# Altium project PS004.PrjPcb
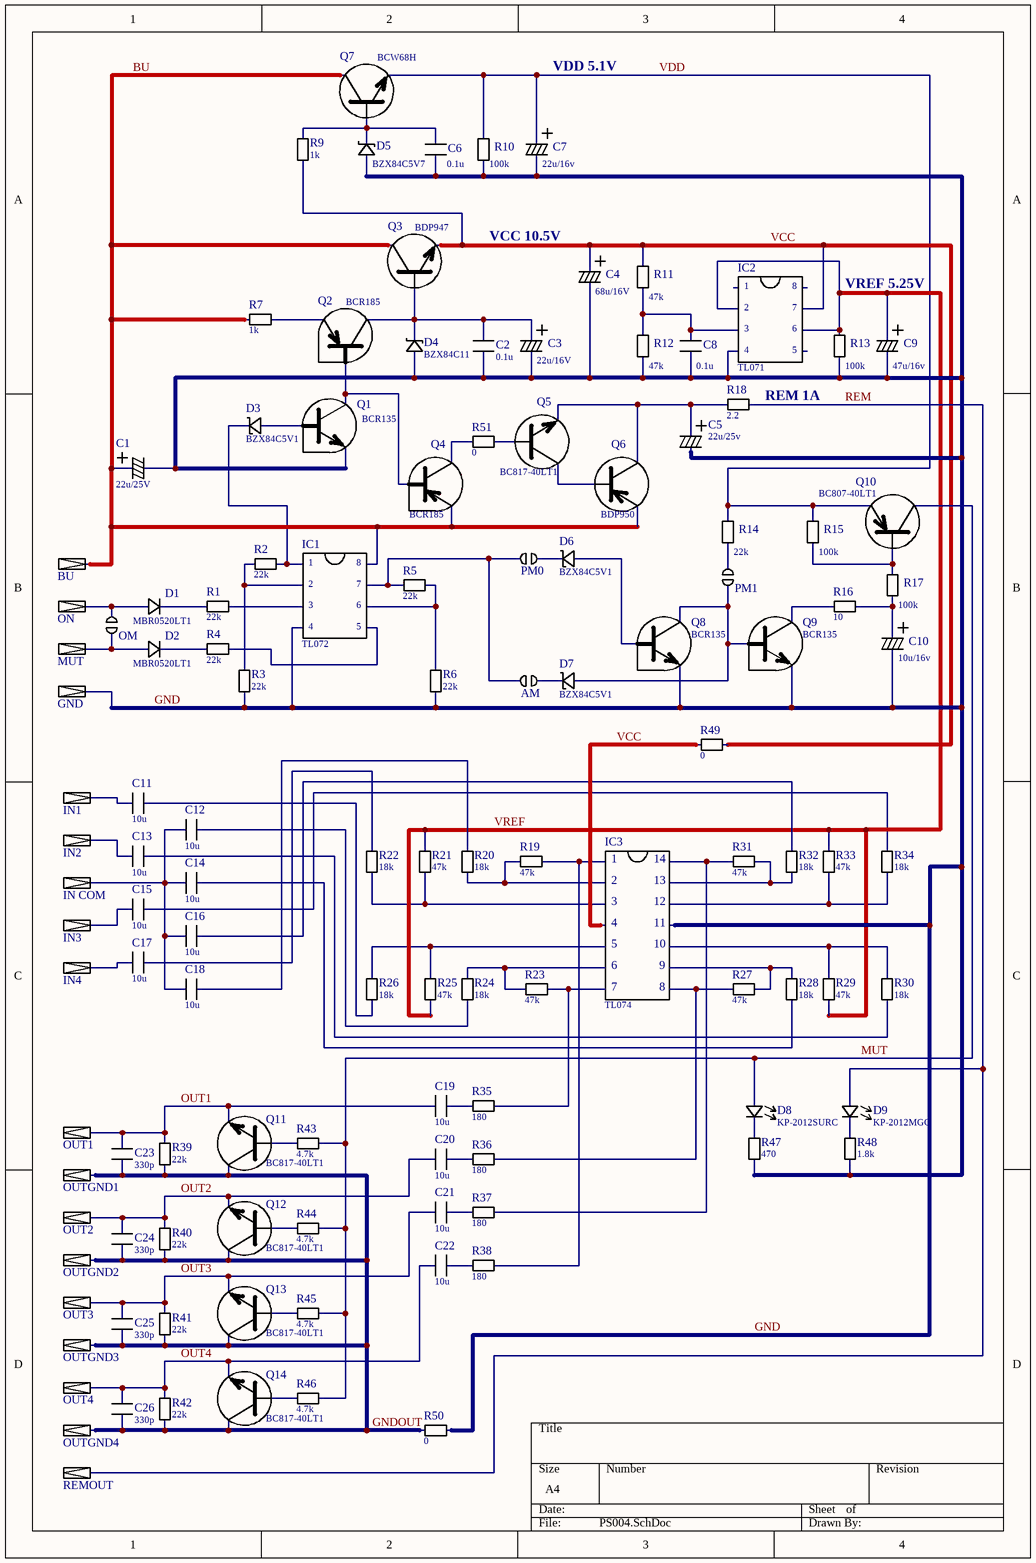
[diagram p0: PS004.SchDoc]
1 sheet, 124 parts. Net scope: global (net labels, ports and power ports of the same name join across sheets).
Board file: PS004.PcbDoc

## Sheet PS004.SchDoc
size A4 portrait; PageSetup: Record=PageOptions|CenterHorizontal=True|CenterVertical=True|PrintScale=0.97|XCorrection=1.00|YCorrection=1.00|PrintKind=1|BorderSize=5000000|LeftOffset=0|BottomOffset=0|Orientation=1|PaperLength=1000|PaperWidth=1000|Scale=100|PaperSource=7|PrintQuality=-4|MediaType=1|DitherType=10|PaperKind=A4|PrintScaleMode=1

### Parts
AM  SC plan  [SC]  (value not drawn)
BU  IN plan  [IO]  (value not drawn)
C1  Capasitance: 22u/25V  [C]  (hidden comment: C plan pol)
C2  Capasitance: 0.1u  [0805]  (hidden comment: C plan cer)
C3  Capasitance: 22u/16V  [C]  (hidden comment: C plan pol)
C4  Capasitance: 68u/16V  [C]  (hidden comment: C plan pol)
C5  Capasitance: 22u/25v  [C]  (hidden comment: C plan pol)
C6  Capasitance: 0.1u  [0805]  (hidden comment: C plan cer)
C7  Capasitance: 22u/16v  [C]  (hidden comment: C plan pol)
C8  Capasitance: 0.1u  [0805]  (hidden comment: C plan cer)
C9  Capasitance: 47u/16v  [C]  (hidden comment: C plan pol)
C10  Capasitance: 10u/16v  [C]  (hidden comment: C plan pol)
C11  Capasitance: 10u  [1206]  (hidden comment: C plan cer)
C12  Capasitance: 10u  [1206]  (hidden comment: C plan cer)
C13  Capasitance: 10u  [1206]  (hidden comment: C plan cer)
C14  Capasitance: 10u  [1206]  (hidden comment: C plan cer)
C15  Capasitance: 10u  [1206]  (hidden comment: C plan cer)
C16  Capasitance: 10u  [1206]  (hidden comment: C plan cer)
C17  Capasitance: 10u  [1206]  (hidden comment: C plan cer)
C18  Capasitance: 10u  [1206]  (hidden comment: C plan cer)
C19  Capasitance: 10u  [1206]  (hidden comment: C plan cer)
C20  Capasitance: 10u  [1206]  (hidden comment: C plan cer)
C21  Capasitance: 10u  [1206]  (hidden comment: C plan cer)
C22  Capasitance: 10u  [1206]  (hidden comment: C plan cer)
C23  Capasitance: 330p  [0805]  (hidden comment: C plan cer)
C24  Capasitance: 330p  [0805]  (hidden comment: C plan cer)
C25  Capasitance: 330p  [0805]  (hidden comment: C plan cer)
C26  Capasitance: 330p  [0805]  (hidden comment: C plan cer)
D1  Name: MBR0520LT1  [SOD-123]  (hidden comment: D plan)
D2  Name: MBR0520LT1  [SOD-123]  (hidden comment: D plan)
D3  Name: BZX84C5V1  [SOT-23]  (hidden comment: DZ plan)
D4  Name: BZX84C11  [SOT-23]  (hidden comment: DZ plan)
D5  Name: BZX84C5V7  [SOT-23]  (hidden comment: DZ plan)
D6  Name: BZX84C5V1  [SOT-23]  (hidden comment: DZ plan)
D7  Name: BZX84C5V1  [SOT-23]  (hidden comment: DZ plan)
D8  Name: KP-2012SURC  [0805 DI]  (hidden comment: DI plan)
D9  Name: KP-2012MGC  [0805 DI]  (hidden comment: DI plan)
GND  IN plan  [IO]  (value not drawn)
IC1  Name: TL072  [SO-8]  (hidden comment: IC 8 plan)
IC2  Name: TL071  [SO-8]  (hidden comment: IC 8 plan)
IC3  Name: TL074  [SO-14]  (hidden comment: IC 14 plan)
IN1  IN plan  [IO]  (value not drawn)
IN2  IN plan  [IO]  (value not drawn)
IN3  IN plan  [IO]  (value not drawn)
IN4  IN plan  [IO]  (value not drawn)
IN_COM  IN plan  [IO]  (value not drawn)
MUT  IN plan  [IO]  (value not drawn)
OM  SC plan  [SC]  (value not drawn)
ON  IN plan  [IO]  (value not drawn)
OUT1  OUT plan  [IO]  (value not drawn)
OUT2  OUT plan  [IO]  (value not drawn)
OUT3  OUT plan  [IO]  (value not drawn)
OUT4  OUT plan  [IO]  (value not drawn)
OUTGND1  OUT plan  [IO]  (value not drawn)
OUTGND2  OUT plan  [IO]  (value not drawn)
OUTGND3  OUT plan  [IO]  (value not drawn)
OUTGND4  OUT plan  [IO]  (value not drawn)
PM0  SC plan  [SC]  (value not drawn)
PM1  SC plan  [SC]  (value not drawn)
Q1  Name: BCR135  [SOT-23]  (hidden comment: QD npn plan)
Q2  Name: BCR185  [SOT-23]  (hidden comment: QD pnp plan)
Q3  Name: BDP947  [SOT-223]  (hidden comment: Q npn plan)
Q4  Name: BCR185  [SOT-23]  (hidden comment: QD pnp plan)
Q5  Name: BC817-40LT1  [SOT-23]  (hidden comment: Q npn plan)
Q6  Name: BDP950  [SOT-223]  (hidden comment: Q pnp plan)
Q7  Name: BCW68H  [SOT-23]  (hidden comment: Q npn plan)
Q8  Name: BCR135  [SOT-23]  (hidden comment: QD npn plan)
Q9  Name: BCR135  [SOT-23]  (hidden comment: QD npn plan)
Q10  Name: BC807-40LT1  [SOT-23]  (hidden comment: Q pnp plan)
Q11  Name: BC817-40LT1  [SOT-23]  (hidden comment: Q npn plan)
Q12  Name: BC817-40LT1  [SOT-23]  (hidden comment: Q npn plan)
Q13  Name: BC817-40LT1  [SOT-23]  (hidden comment: Q npn plan)
Q14  Name: BC817-40LT1  [SOT-23]  (hidden comment: Q npn plan)
R1  Resistance: 22k  [0805]  (hidden comment: R plan)
R2  Resistance: 22k  [0805]  (hidden comment: R plan)
R3  Resistance: 22k  [0805]  (hidden comment: R plan)
R4  Resistance: 22k  [0805]  (hidden comment: R plan)
R5  Resistance: 22k  [0805]  (hidden comment: R plan)
R6  Resistance: 22k  [0805]  (hidden comment: R plan)
R7  Resistance: 1k  [0805]  (hidden comment: R plan)
R9  Resistance: 1k  [0805]  (hidden comment: R plan)
R10  Resistance: 100k  [0805]  (hidden comment: R plan)
R11  Resistance: 47k  [0805]  (hidden comment: R plan)
R12  Resistance: 47k  [0805]  (hidden comment: R plan)
R13  Resistance: 100k  [0805]  (hidden comment: R plan)
R14  Resistance: 22k  [0805]  (hidden comment: R plan)
R15  Resistance: 100k  [0805]  (hidden comment: R plan)
R16  Resistance: 10  [0805]  (hidden comment: R plan)
R17  Resistance: 100k  [0805]  (hidden comment: R plan)
R18  Resistance: 2.2  [1210]  (hidden comment: R plan)
R19  Resistance: 47k  [0805]  (hidden comment: R plan)
R20  Resistance: 18k  [0805]  (hidden comment: R plan)
R21  Resistance: 47k  [0805]  (hidden comment: R plan)
R22  Resistance: 18k  [0805]  (hidden comment: R plan)
R23  Resistance: 47k  [0805]  (hidden comment: R plan)
R24  Resistance: 18k  [0805]  (hidden comment: R plan)
R25  Resistance: 47k  [0805]  (hidden comment: R plan)
R26  Resistance: 18k  [0805]  (hidden comment: R plan)
R27  Resistance: 47k  [0805]  (hidden comment: R plan)
R28  Resistance: 18k  [0805]  (hidden comment: R plan)
R29  Resistance: 47k  [0805]  (hidden comment: R plan)
R30  Resistance: 18k  [0805]  (hidden comment: R plan)
R31  Resistance: 47k  [0805]  (hidden comment: R plan)
R32  Resistance: 18k  [0805]  (hidden comment: R plan)
R33  Resistance: 47k  [0805]  (hidden comment: R plan)
R34  Resistance: 18k  [0805]  (hidden comment: R plan)
R35  Resistance: 180  [0805]  (hidden comment: R plan)
R36  Resistance: 180  [0805]  (hidden comment: R plan)
R37  Resistance: 180  [0805]  (hidden comment: R plan)
R38  Resistance: 180  [0805]  (hidden comment: R plan)
R39  Resistance: 22k  [0805]  (hidden comment: R plan)
R40  Resistance: 22k  [0805]  (hidden comment: R plan)
R41  Resistance: 22k  [0805]  (hidden comment: R plan)
R42  Resistance: 22k  [0805]  (hidden comment: R plan)
R43  Resistance: 4.7k  [0805]  (hidden comment: R plan)
R44  Resistance: 4.7k  [0805]  (hidden comment: R plan)
R45  Resistance: 4.7k  [0805]  (hidden comment: R plan)
R46  Resistance: 4.7k  [0805]  (hidden comment: R plan)
R47  Resistance: 470  [0805]  (hidden comment: R plan)
R48  Resistance: 1.8k  [0805]  (hidden comment: R plan)
R49  Resistance: 0  [0805]  (hidden comment: R plan)
R50  Resistance: 0  [0805]  (hidden comment: R plan)
R51  Resistance: 0  [0805]  (hidden comment: R plan)
REMOUT  OUT plan  [IOEX]  (value not drawn)

### Nets
BU: BU.1 C1.1 IC1.8 Q3.2 Q4.3 Q6.3 Q7.2 R7.1
GND: C1.2 C2.1 C3.2 C4.2 C5.2 C6.1 C7.2 C8.1 C9.2 C10.2 D4.1 D5.1 GND.1 IC1.4 IC2.4 IC3.11 Q1.3 Q8.3 Q9.3 R3.1 R6.1 R10.1 R12.1 R13.1 R47.1 R48.1 R50.2
GNDOUT: C23.1 C24.1 C25.1 C26.1 OUTGND1.1 OUTGND2.1 OUTGND3.1 OUTGND4.1 Q11.2 Q12.2 Q13.2 Q14.2 R39.1 R40.1 R41.1 R42.1 R50.1
MUT: D8.2 Q10.2 R43.2 R44.2 R45.2 R46.2
OUT1: C19.1 C23.2 OUT1.1 Q11.3 R39.2
OUT2: C20.1 C24.2 OUT2.1 Q12.3 R40.2
OUT3: C21.1 C25.2 OUT3.1 Q13.3 R41.2
OUT4: C22.1 C26.2 OUT4.1 Q14.3 R42.2
REM: D9.2 R18.2 REMOUT.1
VCC: C4.1 IC2.7 IC3.4 Q3.3 R9.1 R11.2 R49.1 R49.2
VDD: C7.1 Q7.3 Q10.3 R10.2 R14.2 R15.2
VREF: C9.1 IC2.2 IC2.6 R13.2 R21.2 R25.2 R29.1 R33.1
NetAM_1: AM.1 IC1.7 PM0.1 R5.1
NetAM_2: AM.2 D7.2
NetC2_2: C2.2 C3.1 D4.2 Q2.2 Q3.1
NetC5_1: C5.1 Q5.3 Q6.2 R18.1
NetC6_2: C6.2 D5.2 Q7.1 R9.2
NetC8_2: C8.2 IC2.3 R11.1 R12.2
NetC10_1: C10.1 R16.1 R17.1
NetC11_1: C11.1 IN1.1
NetC11_2: C11.2 R26.2
NetC12_1: C12.1 C14.1 C16.1 C18.1 IN_COM.1
NetC12_2: C12.2 R24.2
NetC13_1: C13.1 IN2.1
NetC13_2: C13.2 R30.1
NetC14_2: C14.2 R28.1
NetC15_1: C15.1 IN3.1
NetC15_2: C15.2 R34.1
NetC16_2: C16.2 R32.1
NetC17_1: C17.1 IN4.1
NetC17_2: C17.2 R22.2
NetC18_2: C18.2 R20.2
NetC19_2: C19.2 R35.1
NetC20_2: C20.2 R36.1
NetC21_2: C21.2 R37.1
NetC22_2: C22.2 R38.1
NetD1_1: D1.1 R1.1
NetD1_2: D1.2 OM.2 ON.1
NetD2_1: D2.1 R4.1
NetD2_2: D2.2 MUT.1 OM.1
NetD3_1: D3.1 Q1.1
NetD3_2: D3.2 IC1.1 R2.2
NetD6_1: D6.1 Q8.1
NetD6_2: D6.2 PM0.2
NetD7_1: D7.1 PM1.1 Q8.2 Q9.1
NetD8_1: D8.1 R47.2
NetD9_1: D9.1 R48.2
NetIC1_2: IC1.2 R2.1 R3.2
NetIC1_3: IC1.3 R1.2
NetIC1_5: IC1.5 R4.2
NetIC1_6: IC1.6 R5.2 R6.2
NetIC3_1: IC3.1 R19.2 R38.2
NetIC3_2: IC3.2 R19.1 R20.1
NetIC3_3: IC3.3 R21.1 R22.1
NetIC3_5: IC3.5 R25.1 R26.1
NetIC3_6: IC3.6 R23.2 R24.1
NetIC3_7: IC3.7 R23.1 R35.2
NetIC3_8: IC3.8 R27.1 R36.2
NetIC3_9: IC3.9 R27.2 R28.2
NetIC3_10: IC3.10 R29.2 R30.2
NetIC3_12: IC3.12 R33.2 R34.2
NetIC3_13: IC3.13 R31.1 R32.2
NetIC3_14: IC3.14 R31.2 R37.2
NetPM1_2: PM1.2 R14.1
NetQ1_2: Q1.2 Q2.1 Q4.1
NetQ2_3: Q2.3 R7.2
NetQ4_2: Q4.2 R51.1
NetQ5_1: Q5.1 R51.2
NetQ5_2: Q5.2 Q6.1
NetQ9_2: Q9.2 R16.2
NetQ10_1: Q10.1 R15.1 R17.2
NetQ11_1: Q11.1 R43.1
NetQ12_1: Q12.1 R44.1
NetQ13_1: Q13.1 R45.1
NetQ14_1: Q14.1 R46.1

Not connected (* = marked no-connect by the designer): IC2 1 5 8

### Notes on the sheet
- VDD 5.1V
- VCC 10.5V
- VREF 5.25V
- (near R18) REM 1A